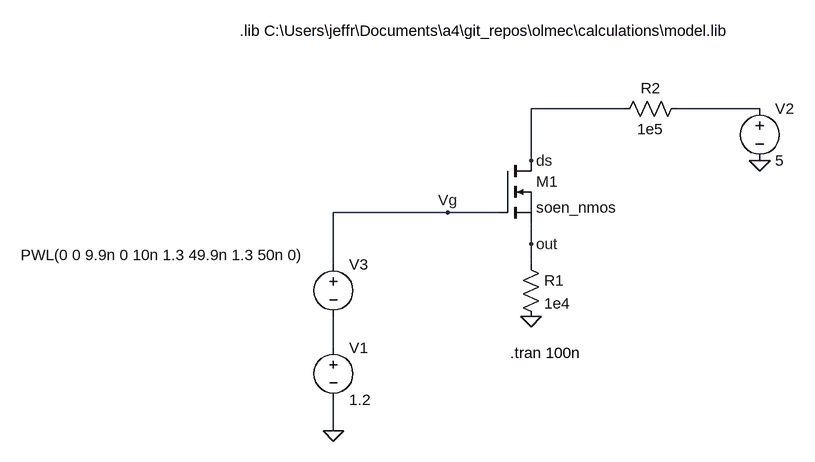
[diagram p0: schematic mosfet_r_gain.asc]
mosfet_r_gain.asc, the LTspice schematic file:
Version 4
SHEET 1 880 680
WIRE -128 144 -272 144
WIRE 80 144 -48 144
WIRE -272 224 -272 144
WIRE -400 304 -576 304
WIRE -320 304 -400 304
WIRE -272 304 -272 272
WIRE -272 352 -272 320
WIRE -576 384 -576 304
WIRE -272 384 -272 352
WIRE -576 512 -576 464
WIRE -576 640 -576 592
FLAG 80 224 0
FLAG -576 640 0
FLAG -272 224 ds
FLAG -400 304 Vg
FLAG -272 464 0
FLAG -272 352 out
SYMBOL voltage 80 128 R0
WINDOW 123 0 0 Left 0
WINDOW 39 0 0 Left 0
SYMATTR InstName V2
SYMATTR Value 5
SYMBOL voltage -576 368 R0
WINDOW 123 0 0 Left 0
WINDOW 39 0 0 Left 0
WINDOW 3 -481 1 Left 2
SYMATTR InstName V3
SYMATTR Value PWL(0 0 9.9n 0 10n 1.3 49.9n 1.3 50n 0)
SYMBOL nmos4 -320 224 R0
SYMATTR InstName M1
SYMATTR Value soen_nmos
SYMATTR Value2 l=1u w=5u
SYMBOL res -288 368 R0
SYMATTR InstName R1
SYMATTR Value 1e4
SYMBOL voltage -576 496 R0
WINDOW 123 0 0 Left 0
WINDOW 39 0 0 Left 0
SYMATTR InstName V1
SYMATTR Value 1.2
SYMBOL res -32 128 R90
WINDOW 0 0 56 VBottom 2
WINDOW 3 32 56 VTop 2
SYMATTR InstName R2
SYMATTR Value 1e5
TEXT -304 520 Left 2 !.tran 100n
TEXT -720 24 Left 2 !.lib C:\\Users\\jeffr\\Documents\\a4\\git_repos\\olmec\\calculations\\model.lib

The netlist it stands for:
* mosfet_r_gain.asc
V2 N001 0 5
V3 Vg N003 PWL(0 0 9.9n 0 10n 1.3 49.9n 1.3 50n 0)
M1 ds Vg out N002 soen_nmos l=1u w=5u
R1 out 0 1e4
V1 N003 0 1.2
R2 N001 ds 1e5
.model NMOS NMOS
.model PMOS PMOS
.lib standard.mos
.tran 100n
.lib C:\Users\jeffr\Documents\a4\git_repos\olmec\calculations\model.lib
.backanno
.end